# EAGLE schematic motor_shield_v1.0 (EAGLE 7.6.0)
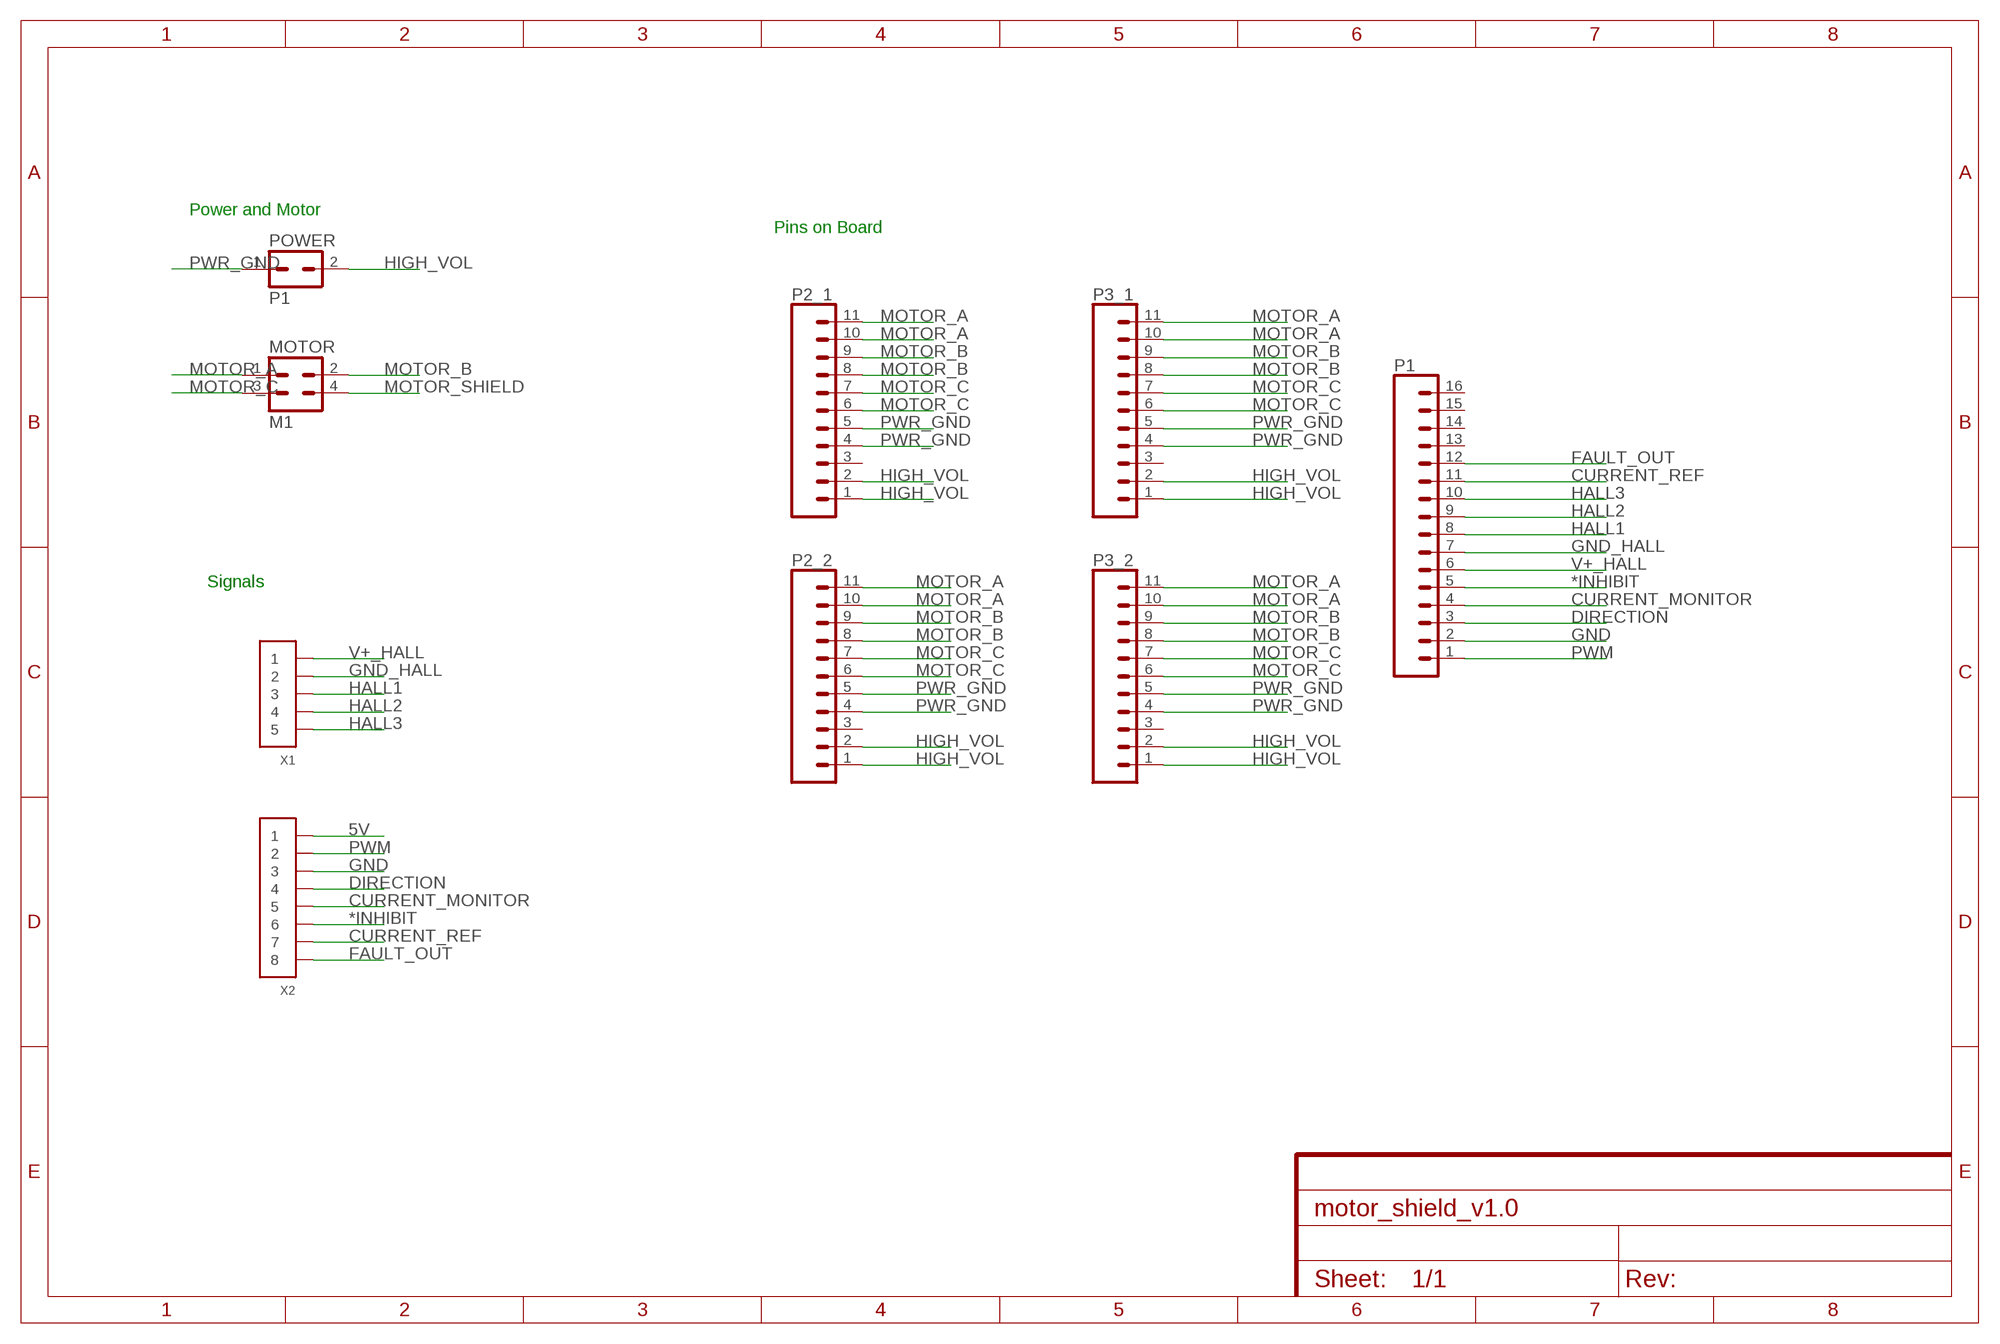
[diagram p0: schematic, sheet 1]

## Parts
MOTOR  M1  39-30-04  [39-30-?04?]
P1  CONN_16LOCK  [1X16_LOCK]
P2_1  CONN_11  [1X11]
P2_2  CONN_11  [1X11]
P3_1  CONN_11  [1X11]
P3_2  CONN_11  [1X11]
POWER  P1  39-30-02  [39-30-?02?]
X1  CONN_5-1-53261  [PB-53261-05]
X2  CONN_8-1-53261  [PB-53261-08]

## Nets
5V: X2.1
*INHIBIT: P1.5 X2.6
CURRENT_MONITOR: P1.4 X2.5
CURRENT_REF: P1.11 X2.7
DIRECTION: P1.3 X2.4
FAULT_OUT: P1.12 X2.8
GND: P1.2 X2.3
GND_HALL: P1.7 X1.2
HALL1: P1.8 X1.3
HALL2: P1.9 X1.4
HALL3: P1.10 X1.5
HIGH_VOL: P2_1.1 P2_1.2 P2_2.1 P2_2.2 P3_1.1 P3_1.2 P3_2.1 P3_2.2 POWER.2
MOTOR_A: MOTOR.1 P2_1.10 P2_1.11 P2_2.10 P2_2.11 P3_1.10 P3_1.11 P3_2.10 P3_2.11
MOTOR_B: MOTOR.2 P2_1.8 P2_1.9 P2_2.8 P2_2.9 P3_1.8 P3_1.9 P3_2.8 P3_2.9
MOTOR_C: MOTOR.3 P2_1.6 P2_1.7 P2_2.6 P2_2.7 P3_1.6 P3_1.7 P3_2.6 P3_2.7
MOTOR_SHIELD: MOTOR.4
PWM: P1.1 X2.2
PWR_GND: P2_1.4 P2_1.5 P2_2.4 P2_2.5 P3_1.4 P3_1.5 P3_2.4 P3_2.5 POWER.1
V+_HALL: P1.6 X1.1
Unconnected: P1.13 P1.14 P1.15 P1.16 P2_1.3 P2_2.3 P3_1.3 P3_2.3

## Notes on the sheet
- Power and Motor
- Pins on Board
- Signals

## Library data of the parts
MOTOR = con-molex-mini-fit:39-30-?04?: HEADER
P1 = SparkFun-Connectors:CONN_16: Multi connection point. Often used as Generic Header-pin footprint for 0.1 inch spaced/style header connections On any of the 0.1 inch spaced packages, you can populate with these: Break Away Headers - Straight <https://www.sparkfun.com/products/116> (PRT-00116) Break Away Male Headers - Right Angle <https://www.sparkfun.com/products/553> (PRT-00553) Female Headers <https://www.sparkfun.com/products/115> (PRT-00115) Break Away Headers - Machine Pin <https://www.sparkfun.com/products/117> (PRT-00117) Break Away Female Headers - Swiss Machine Pin <https://www.sparkfun.com/products/743> (PRT-00743) For SCREWTERMINALS and SPRING TERMINALS visit here: Screw Terimnals on SparkFun.com <https://www.sparkfun.com/search/results?term=Screw+Terminals> (5mm/3.5mm/2.54mm spacing) This device is also useful as a general connection point to wire up your design to another part of your project. Our various solder wires solder well into these plated through hole pads. Hook-Up Wire - Assortment (Stranded, 22 AWG) <https://www.sparkfun.com/products/11375> (PRT-11375) Hook-Up Wire - Assortment (Solid Core, 22 AWG) <https://www.sparkfun.com/products/11367> (PRT-11367) View the entire wire category on our website here <https://www.sparkfun.com/categories/141> Special notes: Molex polarized connector foot print use with SKU : PRT-08231 with associated crimp pins and housings. 1MM SMD Version SKU: PRT-10208 NOTES ON THE VARIANTS LOCK and LOCK_LONGPADS... This footprint was designed to help hold the alignment of a through-hole component (i.e. 6-pin header) while soldering it into place. You may notice that each hole has been shifted either up or down by 0.005 of an inch from it's more standard position (which is a perfectly straight line). This slight alteration caused the pins (the squares in the middle) to touch the edges of the holes. Because they are alternating, it causes a "brace" to hold the component in place. 0.005 has proven to be the perfect amount of "off-center" position when using our standard breakaway headers. Although looks a little odd when you look at the bare footprint, once you have a header in there, the alteration is very hard to notice. Also,if you push a header all the way into place, it is covered up entirely on the bottom side.
P2_1 P2_2 P3_1 P3_2 = SparkFun-Connectors:CONN_11: Multi connection point. Often used as Generic Header-pin footprint for 0.1 inch spaced/style header connections On any of the 0.1 inch spaced packages, you can populate with these: Break Away Headers - Straight <https://www.sparkfun.com/products/116> (PRT-00116) Break Away Male Headers - Right Angle <https://www.sparkfun.com/products/553> (PRT-00553) Female Headers <https://www.sparkfun.com/products/115> (PRT-00115) Break Away Headers - Machine Pin <https://www.sparkfun.com/products/117> (PRT-00117) Break Away Female Headers - Swiss Machine Pin <https://www.sparkfun.com/products/743> (PRT-00743) For SCREWTERMINALS and SPRING TERMINALS visit here: Screw Terimnals on SparkFun.com <https://www.sparkfun.com/search/results?term=Screw+Terminals> (5mm/3.5mm/2.54mm spacing) This device is also useful as a general connection point to wire up your design to another part of your project. Our various solder wires solder well into these plated through hole pads. Hook-Up Wire - Assortment (Stranded, 22 AWG) <https://www.sparkfun.com/products/11375> (PRT-11375) Hook-Up Wire - Assortment (Solid Core, 22 AWG) <https://www.sparkfun.com/products/11367> (PRT-11367) View the entire wire category on our website here <https://www.sparkfun.com/categories/141>
POWER = con-molex-mini-fit:39-30-?02?: HEADER
X1 = pel_molex:CONN_5-1
X2 = pel_molex:CONN_8-1